# EAGLE design PicKit2Clone2 (EAGLE 7.6.0)
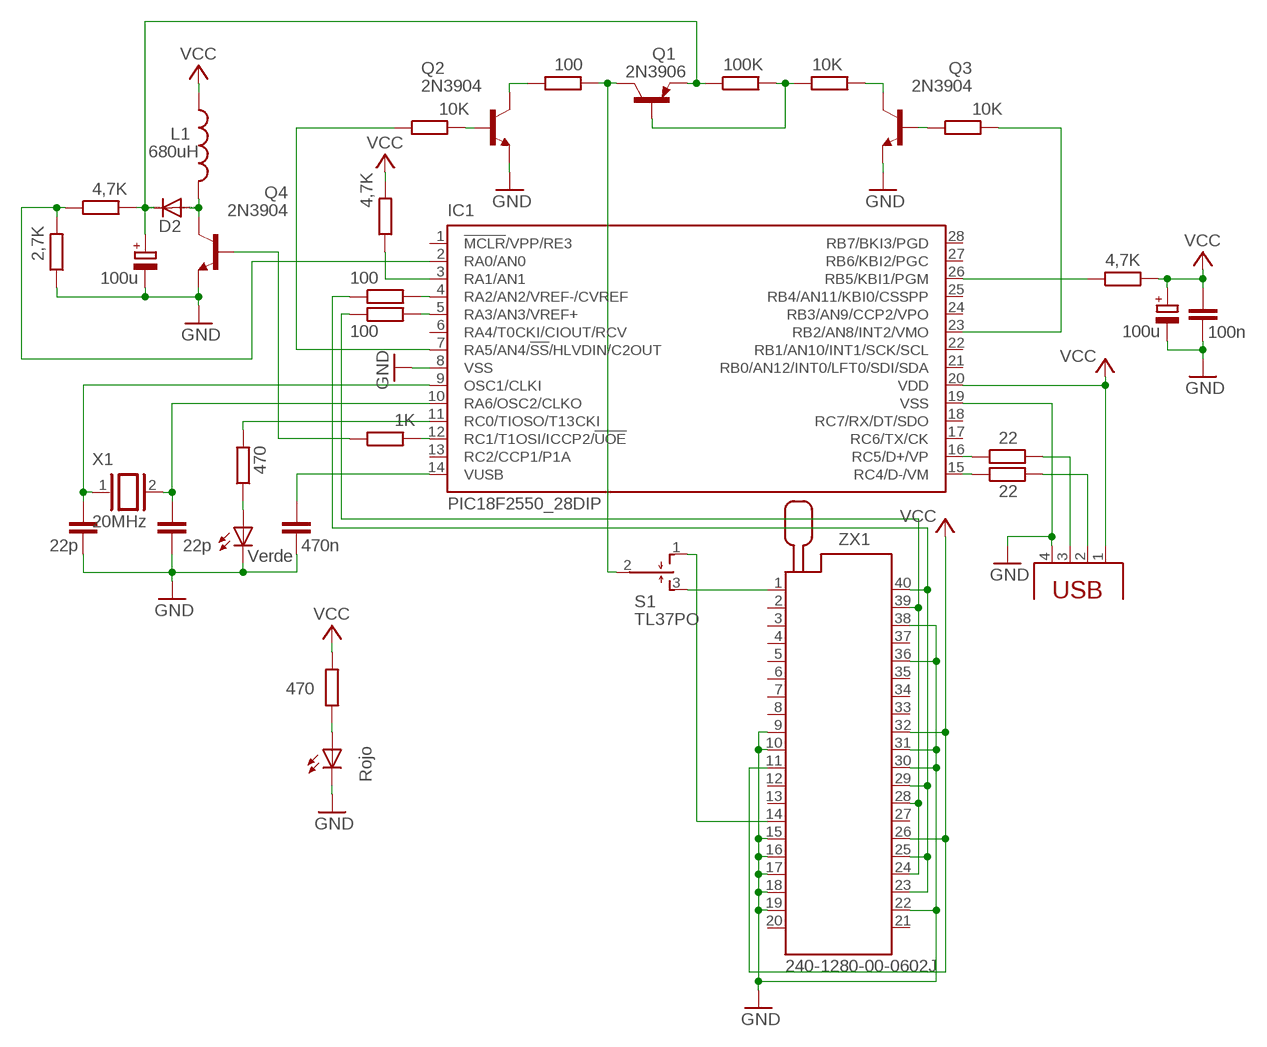
[diagram p0: schematic, sheet 1]

## Parts
C1  22p  C-EU075-032X103  [C075-032X103]
C2  22p  C-EU075-032X103  [C075-032X103]
C3  100n  C-EU075-032X103  [C075-032X103]
C4  100u  CPOL-EUE2,5-6E  [E2,5-6E]
C5  470n  C-EU075-032X103  [C075-032X103]
C6  100u  CPOL-EUE2,5-6E  [E2,5-6E]
D2  1N4148DO35-7  [DO35-7]
IC1  PIC18F2550_28DIP  [DIL28-3]
L1  680uH  L-US0207/7  [0207/7]
LED1  Verde  LED3MM  [LED3MM]
LED2  Rojo  LED3MM  [LED3MM]
Q1  2N3906  [TO92]
Q2  2N3904  [TO92]
Q3  2N3904  [TO92]
Q4  2N3904  [TO92]
R1  22  R-EU_0207/7  [0207/7]
R2  22  R-EU_0207/7  [0207/7]
R3  470  R-EU_0207/7  [0207/7]
R4  470  R-EU_0207/7  [0207/7]
R5  1K  R-EU_0207/7  [0207/7]
R6  2,7K  R-EU_0207/7  [0207/7]
R7  4,7K  R-EU_0207/7  [0207/7]
R8  100K  R-EU_0207/7  [0207/7]
R9  10K  R-EU_0207/7  [0207/7]
R10  10K  R-EU_0207/7  [0207/7]
R11  100  R-EU_0207/7  [0207/7]
R12  100  R-EU_0207/7  [0207/7]
R13  100  R-EU_0207/7  [0207/7]
R14  10K  R-EU_0207/7  [0207/7]
R15  4,7K  R-EU_0207/7  [0207/7]
R16  4,7K  R-EU_0207/7  [0207/7]
S1  TL37PO  [TL3XPO]
USB  PN87520  [PN87520]
X1  20MHz  XTAL/S  [QS]
ZX1  240-1280-00-0602J  [240-1280-00-0602J]

## Nets
GND: C1.2 C2.2 C3.1 C4.- C5.1 C6.- IC1.8(VSS) IC1.19(VSS) LED1.K(C) LED2.K(C) Q2.3(E) Q3.3(E) Q4.3(E) R6.1 USB.4 ZX1.9 ZX1.10 ZX1.15 ZX1.16 ZX1.17 ZX1.18 ZX1.19 ZX1.22 ZX1.30 ZX1.31 ZX1.36 ZX1.38
N$1: C2.1 IC1.10(RA6/OSC2/CLKO) X1.2
N$2: C1.1 IC1.9(OSC1/CLKI) X1.1
N$3: LED1.A R3.1
N$4: IC1.11(RC0/TIOSO/T13CKI) R3.2
N$5: C5.2 IC1.14(VUSB)
N$6: Q1.1(C) R11.2 S1.2(P)
N$7: IC1.26(RB5/KBI1/PGM) R7.1
N$8: Q1.2(B) R8.2 R10.1
N$9: Q2.1(C) R11.1
N$10: R1.2 USB.2
N$11: IC1.15(RC4/D-/VM) R1.1
N$12: IC1.16(RC5/D+/VP) R2.1
N$13: R2.2 USB.3
N$14: IC1.3(RA1/AN1) R15.1
N$15: IC1.4(RA2/AN2/VREF-/CVREF) R13.2
N$16: Q3.1(C) R10.2
N$17: IC1.7(RA5/AN4/!SS!/HLVDIN/C2OUT) R14.1
N$18: Q2.2(B) R14.2
N$19: Q3.2(B) R9.1
N$20: IC1.23(RB2/AN8/INT2/VMO) R9.2
N$21: LED2.A R4.1
N$22: IC1.12(RC1/T1OSI/ICCP2/!UOE) R5.2
N$23: D2.A L1.2 Q4.1(C)
N$24: C6.+ D2.C Q1.3(E) R8.1 R16.2
N$25: IC1.2(RA0/AN0) R6.2 R16.1
N$26: Q4.2(B) R5.1
N$27: IC1.5(RA3/AN3/VREF+) R12.2
N$28: S1.1(O) ZX1.14
N$29: S1.3(S) ZX1.1
N$30: R12.1 ZX1.24 ZX1.28 ZX1.39
N$31: R13.1 ZX1.23 ZX1.25 ZX1.29 ZX1.40
VCC: C3.2 C4.+ IC1.20(VDD) L1.1 R4.2 R7.2 R15.2 USB.1 ZX1.11 ZX1.26 ZX1.32
Unconnected: IC1.1(!MCLR!/VPP/RE3) IC1.6(RA4/T0CKI/CIOUT/RCV) IC1.13(RC2/CCP1/P1A) IC1.17(RC6/TX/CK) IC1.18(RC7/RX/DT/SDO) IC1.21(RB0/AN12/INT0/LFT0/SDI/SDA) IC1.22(RB1/AN10/INT1/SCK/SCL) IC1.24(RB3/AN9/CCP2/VPO) IC1.25(RB4/AN11/KBI0/CSSPP) IC1.27(RB6/KBI2/PGC) IC1.28(RB7/BKI3/PGD) ZX1.2 ZX1.3 ZX1.4 ZX1.5 ZX1.6 ZX1.7 ZX1.8 ZX1.12 ZX1.13 ZX1.20 ZX1.21 ZX1.27 ZX1.33 ZX1.34 ZX1.35 ZX1.37

## Library data of the parts
C1-C3 C5 = rcl:C-EU: CAPACITOR, European symbol
C4 C6 = rcl:CPOL-EU: POLARIZED CAPACITOR, European symbol
D2 = diode:1N4148: DIODE high speed (Philips)
IC1 = microchip:PIC18F2*_28: USB Microcontrollers with nanoWatt Technology High-Performance, Enhanced Flash, 28/40/44-Pin, Source: http://ww1.microchip.com/downloads/en/devicedoc/39632c.pdf; MF: MICROCHIP; MPN: PIC18F2550-I/SP; OC_FARNELL: 1523822; OC_NEWARK: 80K6054
L1 = rcl:L-US: INDUCTOR, American symbol
LED1 LED2 = led:LED: LED OSRAM: - CHIPLED LG R971, LG N971, LY N971, LG Q971, LY Q971, LO R971, LY R971 LH N974, LH R974 LS Q976, LO Q976, LY Q976 LO Q996 - Hyper CHIPLED LW Q18S LB Q993, LB Q99A, LB R99A - SideLED LS A670, LO A670, LY A670, LG A670, LP A670 LB A673, LV A673, LT A673, LW A673 LH A674 LY A675 LS A676, LA A676, LO A676, LY A676, LW A676 LS A679, LY A679, LG A679 - Hyper Micro SIDELED® LS Y876, LA Y876, LO Y876, LY Y876 LT Y87S - SmartLED LW L88C, LW L88S LB L89C, LB L89S, LG L890 LS L89K, LO L89K, LY L89K LS L896, LA L896, LO L896, LY L896 - TOPLED LS T670, LO T670, LY T670, LG T670, LP T670 LSG T670, LSP T670, LSY T670, LOP T670, LYG T670 LG T671, LOG T671, LSG T671 LB T673, LV T673, LT T673, LW T673 LH T674 LS T676, LA T676, LO T676, LY T676, LB T676, LH T676, LSB T676, LW T676 LB T67C, LV T67C, LT T67C, LS T67K, LO T67K, LY T67K, LW E67C LS E67B, LA E67B, LO E67B, LY E67B, LB E67C, LV E67C, LT E67C LW T67C LS T679, LY T679, LG T679 LS T770, LO T770, LY T770, LG T770, LP T770 LB T773, LV T773, LT T773, LW T773 LH T774 LS E675, LA E675, LY E675, LS T675 LS T776, LA T776, LO T776, LY T776, LB T776 LHGB T686 LT T68C, LB T68C - Hyper Mini TOPLED® LB M676 - Mini TOPLED Santana® LG M470 LS M47K, LO M47K, LY M47K Source: http://www.osram.convergy.de LUXEON: - LUMILED® LXK2-PW12-R00, LXK2-PW12-S00, LXK2-PW14-U00, LXK2-PW14-V00 LXK2-PM12-R00, LXK2-PM12-S00, LXK2-PM14-U00 LXK2-PE12-Q00, LXK2-PE12-R00, LXK2-PE12-S00, LXK2-PE14-T00, LXK2-PE14-U00 LXK2-PB12-K00, LXK2-PB12-L00, LXK2-PB12-M00, LXK2-PB14-N00, LXK2-PB14-P00, LXK2-PB14-Q00 LXK2-PR12-L00, LXK2-PR12-M00, LXK2-PR14-Q00, LXK2-PR14-R00 LXK2-PD12-Q00, LXK2-PD12-R00, LXK2-PD12-S00 LXK2-PH12-R00, LXK2-PH12-S00 LXK2-PL12-P00, LXK2-PL12-Q00, LXK2-PL12-R00 Source: www.luxeon.com KINGBRIGHT: KA-3528ASYC Source: www.kingbright.com
Q1 = transistor-pnp:2N3906: PNP Transistor
Q2-Q4 = transistor:2N3904: NPN TRANSISTOR
R1-R16 = rcl:R-EU_: RESISTOR, European symbol
S1 = switch:TL37PO: TINY SWITCH MOM OFF MOM Source: http://www2.produktinfo.conrad.com/datenblaetter/700000-724999/705152-da-01-de-Subminiaturschalter_TL_36YO.pdf
USB = con-berg:PN87520: BERG USB connector; OC_FARNELL: unknown; OC_NEWARK: unknown
X1 = special:XTAL/S: CRYSTAL
ZX1 = con-3m:240-?-00-0602J: Zero Insertion Force Socked Source: http://www.3M.com/ehpd; MF: 3M; MPN: 240-1280-00-0602J; OC_FARNELL: 9897364; OC_NEWARK: 85K7848

## Board
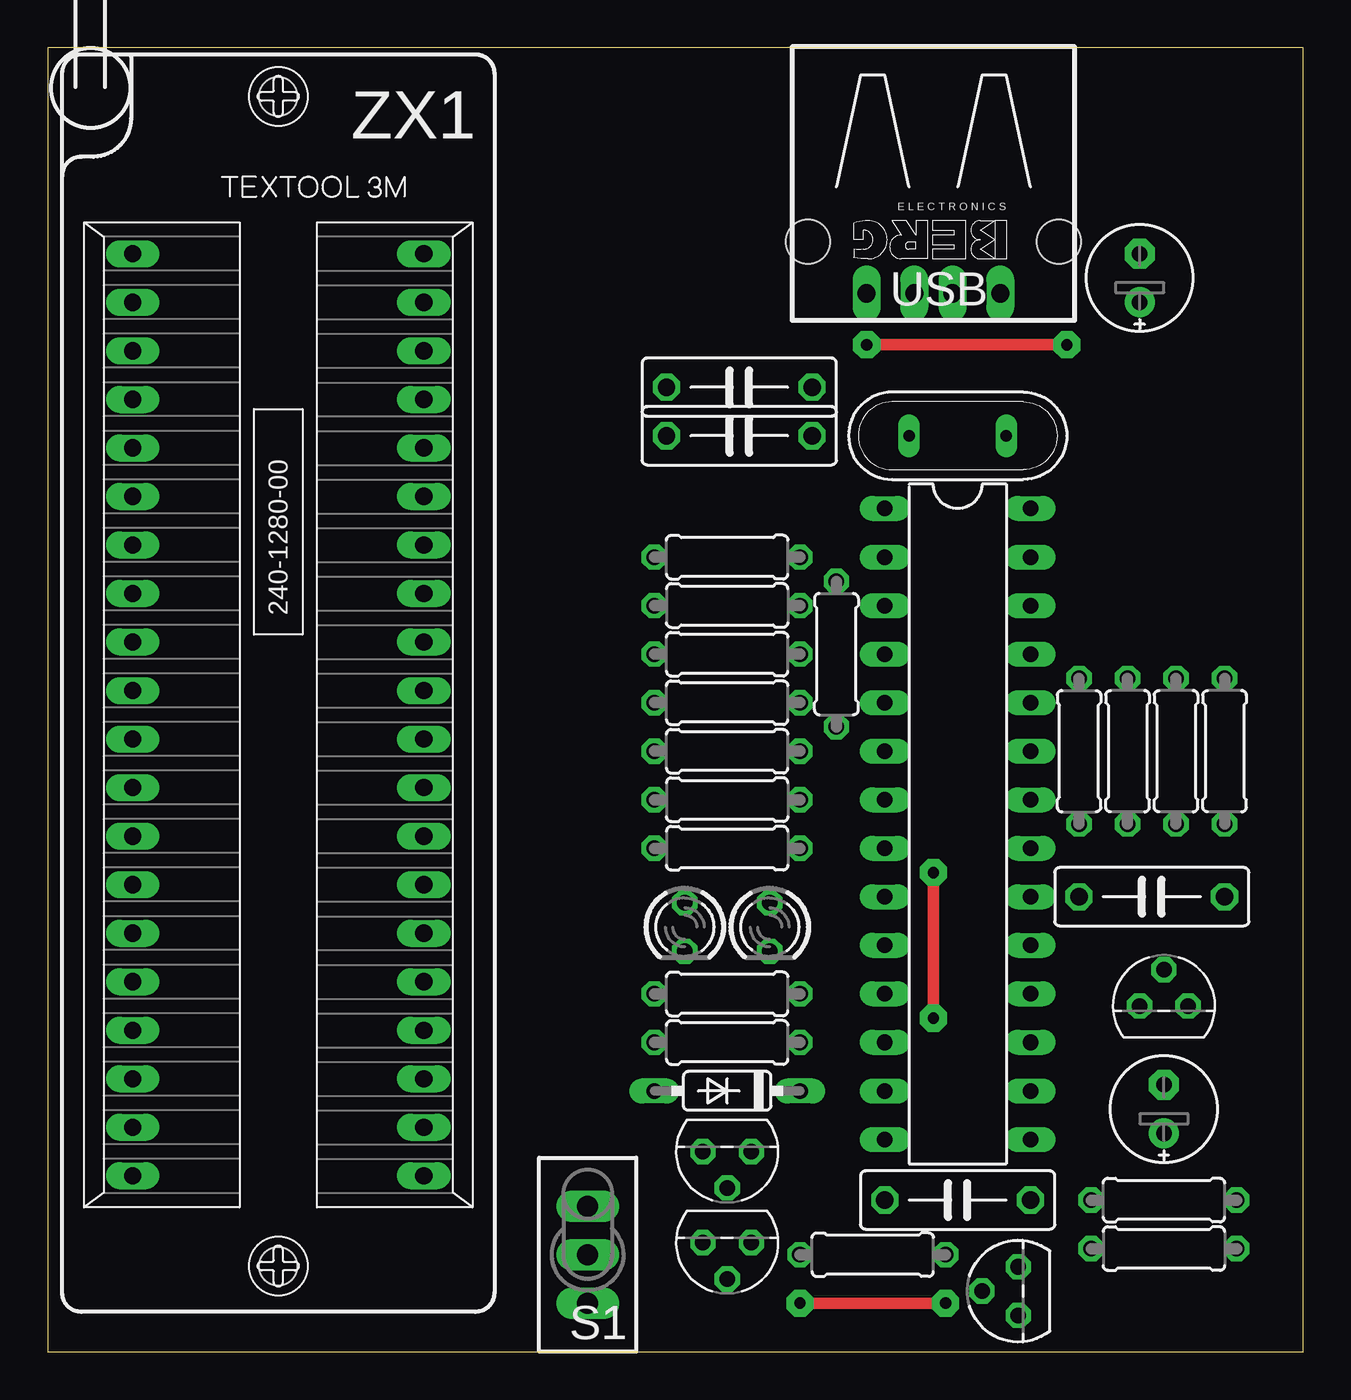
[diagram p1: board, top side]
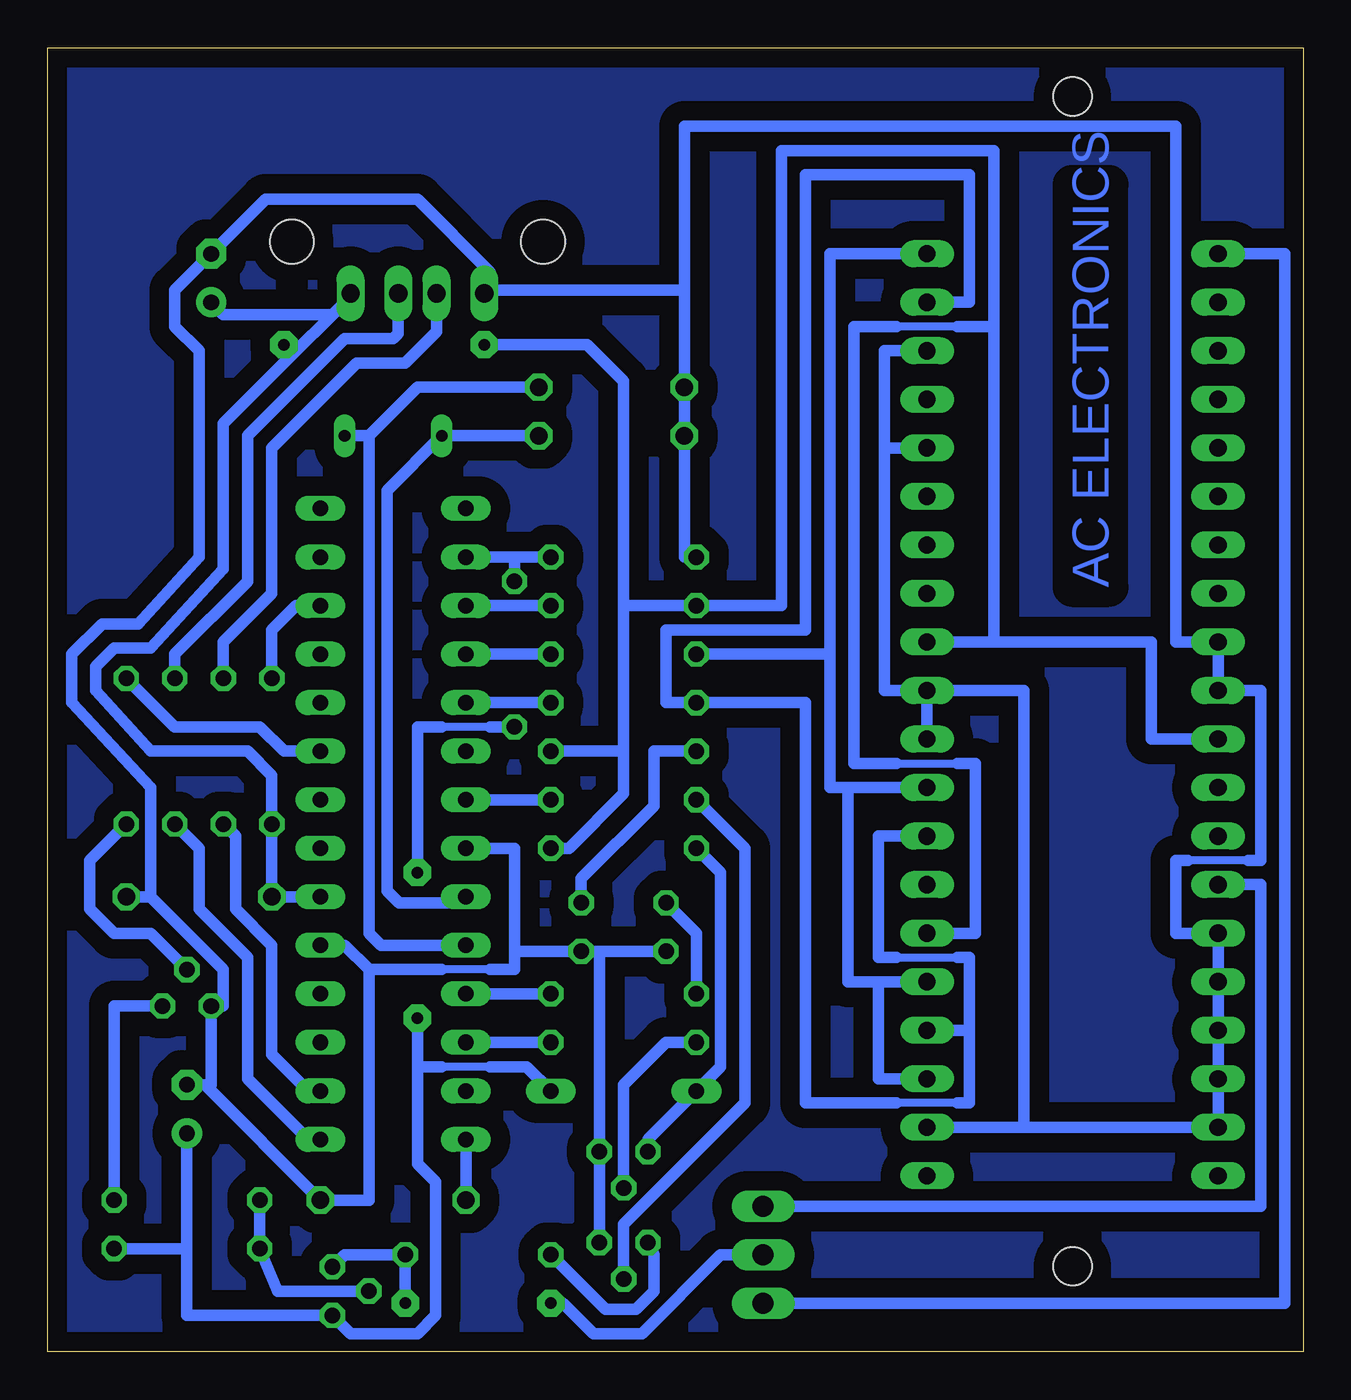
[diagram p2: board, bottom side, seen from below]

Size 65.7 x 68.25 mm. Coordinates in mm from the lower left corner, seen from the top.
Outline: 0,0 65.7,0 65.7,68.25 0,68.25 0,0
Copper layers (1*16): Top 0.035mm / dielectric 1.5mm / Bottom 0.035mm
Design rules "default": minimum track width 10mil, minimum drill 24mil, track to track 8mil, track to pad 8mil, pad to pad 8mil, via to via 8mil, smd to smd 8mil, copper to edge 40mil, drill to drill 8mil, minimum pad ring 10mil, minimum via ring 8mil, stop-mask expansion 4mil, vias tented up to drill 0mil, thermal gap 10mil

### Footprints (pad centres in the part's own frame; a part is rotated, then mirrored left to right if it is on the bottom)
C075-032X103 = drill 0.914 octagon: 1 -3.81,0; 2 3.81,0
E2,5-6E = drill 0.813 pad 1.575: + -1.27,0 | drill 0.813 pad 1.575 octagon: - 1.27,0
DO35-7 = drill 0.813 long: A 3.81,0; C -3.81,0
DIL28-3 = drill 0.813 long: 1 -16.51,-3.81; 2 -13.97,-3.81; 3 -11.43,-3.81; 4 -8.89,-3.81; 5 -6.35,-3.81; 6 -3.81,-3.81; 7 -1.27,-3.81; 8 1.27,-3.81; 9 3.81,-3.81; 10 6.35,-3.81; 11 8.89,-3.81; 12 11.43,-3.81; 13 13.97,-3.81; 14 16.51,-3.81; 15 16.51,3.81; 16 13.97,3.81; 17 11.43,3.81; 18 8.89,3.81; 19 6.35,3.81; 20 3.81,3.81; 21 1.27,3.81; 22 -1.27,3.81; 23 -3.81,3.81; 24 -6.35,3.81; 25 -8.89,3.81; 26 -11.43,3.81; 27 -13.97,3.81; 28 -16.51,3.81
0207/7 = drill 0.813 octagon: 1 -3.81,0; 2 3.81,0
LED3MM = drill 0.813 octagon: A -1.27,0; K 1.27,0
TO92 = drill 0.813 octagon: 1 1.27,0; 2 0,1.905; 3 -1.27,0
TL3XPO = drill 1.1 pad 1.422 long: 1 -2.54,0; 2 0,0; 3 2.54,0
PN87520 = drill 0.95 long: 1 -3.5,2.71; 2 -1,2.71; 3 1,2.71; 4 3.5,2.71 | hole 2.3: -6.57,0; 6.57,0
QS = drill 0.61 long: 1 -2.54,0; 2 2.54,0
240-1280-00-0602J = drill 0.9 long: 1 -24.13,-7.62; 2 -21.59,-7.62; 3 -19.05,-7.62; 4 -16.51,-7.62; 5 -13.97,-7.62; 6 -11.43,-7.62; 7 -8.89,-7.62; 8 -6.35,-7.62; 9 -3.81,-7.62; 10 -1.27,-7.62; 11 1.27,-7.62; 12 3.81,-7.62; 13 6.35,-7.62; 14 8.89,-7.62; 15 11.43,-7.62; 16 13.97,-7.62; 17 16.51,-7.62; 18 19.05,-7.62; 19 21.59,-7.62; 20 24.13,-7.62; 21 24.13,7.62; 22 21.59,7.62; 23 19.05,7.62; 24 16.51,7.62; 25 13.97,7.62; 26 11.43,7.62; 27 8.89,7.62; 28 6.35,7.62; 29 3.81,7.62; 30 1.27,7.62; 31 -1.27,7.62; 32 -3.81,7.62; 33 -6.35,7.62; 34 -8.89,7.62; 35 -11.43,7.62; 36 -13.97,7.62; 37 -16.51,7.62; 38 -19.05,7.62; 39 -21.59,7.62; 40 -24.13,7.62 | hole 2: 28.86,0; -32.36,0

### Placement (x,y rotation side)
C1  36.2,47.94 180 top
C2  36.2,50.48 180 top
C3  57.78,23.81 180 top
C4  57.15,56.2 90 top
C5  47.62,7.94 180 top
C6  58.42,12.7 90 top
D2  35.56,13.65 180 top
IC1  47.62,27.62 270 top
L1  35.56,26.35 180 top
LED1  33.34,22.23 270 top
LED2  37.78,22.23 270 top
Q1  50.8,3.17 90 top
Q2  35.56,5.71 180 top
Q3  58.42,18.1 0 top
Q4  35.56,10.48 180 top
R1  59.05,31.43 90 top
R2  56.52,31.43 90 top
R3  35.56,18.73 0 top
R4  35.56,31.43 0 top
R5  35.56,16.19 0 top
R6  35.56,41.59 0 top
R7  53.98,31.43 270 top
R8  58.42,5.4 180 top
R9  61.59,31.43 90 top
R10  58.42,7.94 0 top
R11  43.18,5.08 0 top
R12  35.56,33.97 0 top
R13  35.56,36.51 0 top
R14  35.56,28.89 180 top
R15  35.56,39.05 180 top
R16  41.27,36.51 270 top
S1  28.26,5.08 270 top
USB  46.35,58.1 180 top
X1  47.62,47.94 0 top
ZX1  12.06,33.34 270 top

### Tracks (layer width: path | path; a pad name or v marks a point on that pad's centre or on a via)
GND
  Bottom 0.406: 2.86,25.72 6.03,25.72 | 42.55,20 45.09,20
  Bottom 0.61: C2.2 C1.2 32.38,41.59 R6.1 | C2.2 32.38,55.56 42.85,55.56 USB.4 42.55,55.7 42.55,56.52 46.35,60.33 54.29,60.33 C4.- 59.05,55.56 59.05,53.66 57.78,52.39 57.78,41.59 60.96,38.1 62.87,38.1 64.45,36.51 64.45,33.97 60.33,29.53 60.33,23.81 | 60.33,23.81 C3.1 | 60.33,23.81 56.52,20 56.52,18.1 Q3.3 57.15,13.97 C6.- 57.47,13.97 C5.1 48.9,7.94 48.9,20 | 48.9,20 50.16,21.27 IC1.19 | IC1.8 41.27,26.35 41.27,20.95 | 36.83,20.95 LED2.K 41.27,20.95 | 36.83,20.95 LED1.K | 36.83,20.95 Q4.3 Q2.3 | 41.27,20.95 41.27,20 42.55,20 | ZX1.22 14.61,11.75 | 14.61,11.75 ZX1.19 ZX1.18 ZX1.17 ZX1.16 ZX1.15 6.67,21.91 6.67,25.72 6.03,25.72 | ZX1.31 14.61,34.61 14.61,11.75 | ZX1.30 ZX1.31 | ZX1.31 21.91,34.61 21.91,47.31 | ZX1.36 21.91,47.31 | C2.2 32.38,64.14 6.67,64.14 6.67,37.15 ZX1.9 ZX1.10 2.22,34.61 2.22,25.72 2.86,25.72 | 21.91,47.31 21.91,52.39 ZX1.38 | 45.09,20 48.9,20
N$1
  Bottom 0.61: 48.9,47.94 X1.2 | IC1.10 48.26,21.27 48.9,21.91 48.9,47.94 | C2.1 46.35,50.48 48.9,47.94
N$2
  Bottom 0.61: C1.1 X1.1 47.94,45.09 47.94,24.13 47.31,23.5 43.81,23.5 IC1.9
N$3
  Bottom 0.61: R3.1 31.75,21.91 LED1.A
N$4
  Bottom 0.61: IC1.11 R3.2
N$5
  Bottom 0.61: IC1.14 C5.2
N$6  (via drill 0.6 pad 1.42)
  Top 0.61: v39.37,2.54 v46.99,2.54
  Bottom 0.61: Q1.1 50.16,5.08 R11.2 v46.99,2.54 | S1.2 30.48,5.08 34.61,0.95 37.15,0.95 38.73,2.54 v39.37,2.54
N$7
  Bottom 0.61: IC1.26 52.7,39.05 53.98,37.78 R7.1
N$8
  Bottom 0.61: R10.1 R8.2 53.66,3.17 Q1.2
N$9
  Bottom 0.61: R11.1 36.51,2.22 34.92,2.22 33.97,3.17 33.97,5.08 Q2.1
N$10
  Bottom 0.61: USB.2 47.35,53.29 47.62,53.02 50.16,53.02 55.24,47.94 55.24,40.32 59.05,36.51 R1.2
N$11
  Bottom 0.61: IC1.15 52.07,11.11 55.24,14.29 55.24,20.64 57.78,23.18 57.78,26.35 R1.1
N$12
  Bottom 0.61: IC1.16 52.07,13.65 53.98,15.56 53.98,21.27 55.88,23.18 55.88,26.99 R2.1
N$13
  Bottom 0.61: USB.3 45.35,53.39 46.99,51.75 49.53,51.75 53.98,47.31 53.98,39.69 56.52,37.15 R2.2
N$14
  Bottom 0.61: IC1.3 R15.1
N$15
  Bottom 0.61: R13.2 IC1.4
N$16
  Bottom 0.61: Q3.1 62.23,18.1 R10.2
N$17
  Bottom 0.61: IC1.7 R14.1
N$18
  Bottom 0.61: Q2.2 35.56,6.67 29.21,13.02 29.21,26.35 R14.2
N$19
  Bottom 0.61: Q3.2 60.33,21.91 62.23,21.91 63.5,23.18 63.5,25.72 R9.1
N$20
  Bottom 0.61: IC1.23 53.34,31.43 54.61,32.7 59.05,32.7 R9.2
N$21
  Bottom 0.61: R4.1 33.97,31.43 33.97,28.57 37.78,24.77 LED2.A
N$22
  Bottom 0.61: IC1.12 R5.2
N$23
  Bottom 0.61: L1.2 30.48,25.08 30.48,14.92 D2.A 34.29,11.11 Q4.1
N$24  (via drill 0.6 pad 1.42)
  Top 0.61: v46.35,25.08 v46.35,17.46
  Bottom 0.406: 42.55,32.7 45.09,32.7 | 42.55,14.92 45.09,14.92
  Bottom 0.61: 58.42,5.4 R8.1 | C6.+ 58.42,5.4 | 58.42,5.4 58.42,1.91 Q1.3 49.85,0.95 46.35,0.95 45.4,1.91 45.4,8.89 46.35,9.84 46.35,14.92 | v46.35,25.08 46.35,32.7 45.09,32.7 | D2.C 40.64,14.92 42.55,14.92 | R16.2 42.55,32.7 | 45.09,14.92 46.35,14.92 | v46.35,17.46 46.35,14.92
N$25
  Bottom 0.61: R6.2 41.27,41.59 | 41.27,41.59 IC1.2 | R16.1 41.27,41.59
N$26
  Bottom 0.61: R5.1 33.34,16.19 35.56,13.97 Q4.2
N$27
  Bottom 0.61: IC1.5 R12.2
N$28
  Bottom 0.61: S1.1 2.22,7.62 2.22,24.45 ZX1.14
N$29
  Bottom 0.61: ZX1.1 0.95,57.47 0.95,2.54 S1.3
N$30
  Bottom 0.406: 21.27,20.64 18.1,20.64 | 18.1,13.02 21.27,13.02
  Bottom 0.61: 17.46,16.83 17.46,13.02 18.1,13.02 | 17.46,16.83 ZX1.24 | ZX1.39 17.46,54.93 17.46,61.59 26.04,61.59 26.04,37.78 33.34,37.78 33.34,33.97 R12.1 26.04,33.97 26.04,13.02 21.27,13.02 | 17.46,16.83 17.46,20.64 18.1,20.64 | ZX1.28 22.23,26.99 22.23,20.64 21.27,20.64
N$31
  Bottom 0.61: ZX1.40 24.77,57.47 24.77,36.51 | 24.77,36.51 R13.1 | ZX1.29 23.81,29.53 | ZX1.23 22.23,14.29 22.23,19.37 | ZX1.25 22.23,19.37 | 22.23,19.37 23.81,19.37 23.81,29.53 | 23.81,29.53 24.77,29.53 24.77,36.51
N$32
  pour Bottom (isolate 1.016): 0,68.26 65.72,68.26 65.72,0 0,0
VCC  (via drill 0.6 pad 1.42)
  Top 0.61: v42.86,52.7 v53.34,52.7
  Bottom 0.406: 18.1,53.66 21.27,53.66 | 21.27,30.8 18.1,30.8
  Bottom 0.61: IC1.20 C3.2 R7.2 53.98,30.16 55.24,31.43 60.33,31.43 63.18,34.61 63.18,35.88 62.23,36.83 60.33,36.83 56.52,40.96 56.52,48.58 52.86,52.23 | USB.1 49.85,55.24 50.8,54.29 | 52.86,52.23 50.8,54.29 | 50.8,54.29 56.52,54.29 C4.+ | v53.34,52.7 52.86,52.23 | 35.56,39.05 35.56,50.8 37.47,52.7 v42.86,52.7 | 35.56,39.05 R15.2 27.3,39.05 27.3,62.87 16.19,62.87 16.19,53.66 | 35.56,39.05 35.56,31.43 | 35.56,31.43 R4.2 | 35.56,31.43 35.56,29.21 38.42,26.35 L1.1 | ZX1.11 7.94,32.07 7.94,37.15 16.19,37.15 | 16.19,37.15 16.19,53.66 | ZX1.32 16.19,37.15 | ZX1.26 17.14,21.91 17.14,30.8 18.1,30.8 | 16.19,53.66 18.1,53.66 | 21.27,53.66 23.5,53.66 23.5,30.8 21.27,30.8

### Text on the board
Bottom: AC ELECTRONICS